# Altium schematic sheet M117Z.SchDoc
size A4; SheetNumber: 3; SheetTotal: 17
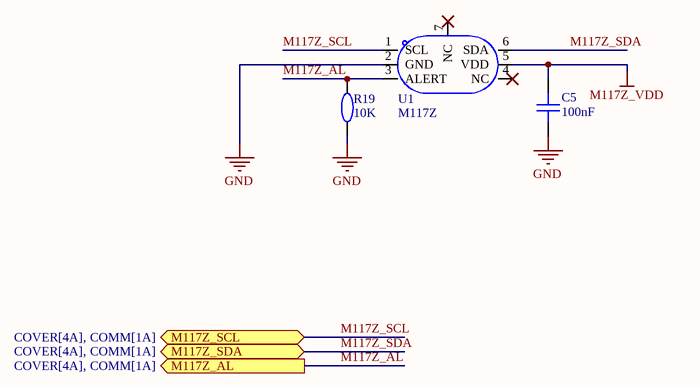
[diagram p0: M117Z.SchDoc]

## Parts
C5  100nF  [C0402]
R19  10K  [R0402]
U1  M117Z  [TDFN-6_L2.0-W2.0-P0.65-TL-EP1.4]

## Ports
M117Z_AL (out, see COVER[4A], COMM[1A]), M117Z_SCL (bidir, see COVER[4A], COMM[1A]), M117Z_SDA (bidir, see COVER[4A], COMM[1A])

## Nets
GND: C5.1 R19.1 U1.2(GND)
M117Z_VDD: C5.2 U1.5(VDD)
M117Z_AL: R19.2 U1.3(ALERT) ; port M117Z_AL
M117Z_SCL: U1.1(SCL) ; port M117Z_SCL
M117Z_SDA: U1.6(SDA) ; port M117Z_SDA

Not connected (* = marked no-connect by the designer): U1 4(NC)* 7(NC)*

## Library data of the parts
C5 = CAP_0402: Symbol: CapAcitance; Device: CAP_0603; Convert to PCB: yes; Add into BOM: yes; Supplier Footprint: 0603; Value: 100nF; Name: 100nF
R19 = Res_0402: Symbol: 电阻; Device: Res_0603; Convert to PCB: yes; Add into BOM: yes; Supplier Footprint: 0603; Value: 10K; Name: 10K
U1 = M117Z: Manufacturer: Mysentech(敏源传感); Add into BOM: yes; Tolerance: ±0.1℃; Voltage - Supply: 1.8V~5.5V; Standby Current: 100nA; Interface: I2C; Symbol: M117Z; Device: M117Z; LCSC Part Name: 0.1℃ I2C数字温度传感器; Supplier Part: C3010933; Manufacturer Part: M117Z; Supplier Footprint: TDFN-6-EP(2x2); Datasheet: https://atta.szlcsc.com/upload/public/pdf/source/20210825/E4930D3FBCA70456AA9027E524284463.pdf; Supplier: LCSC; Convert to PCB: yes; Temperature Range: -70℃~+150℃; Name: M117Z